# EAGLE design Electronic Brick Shield V4.0 pro (EAGLE 5.06)
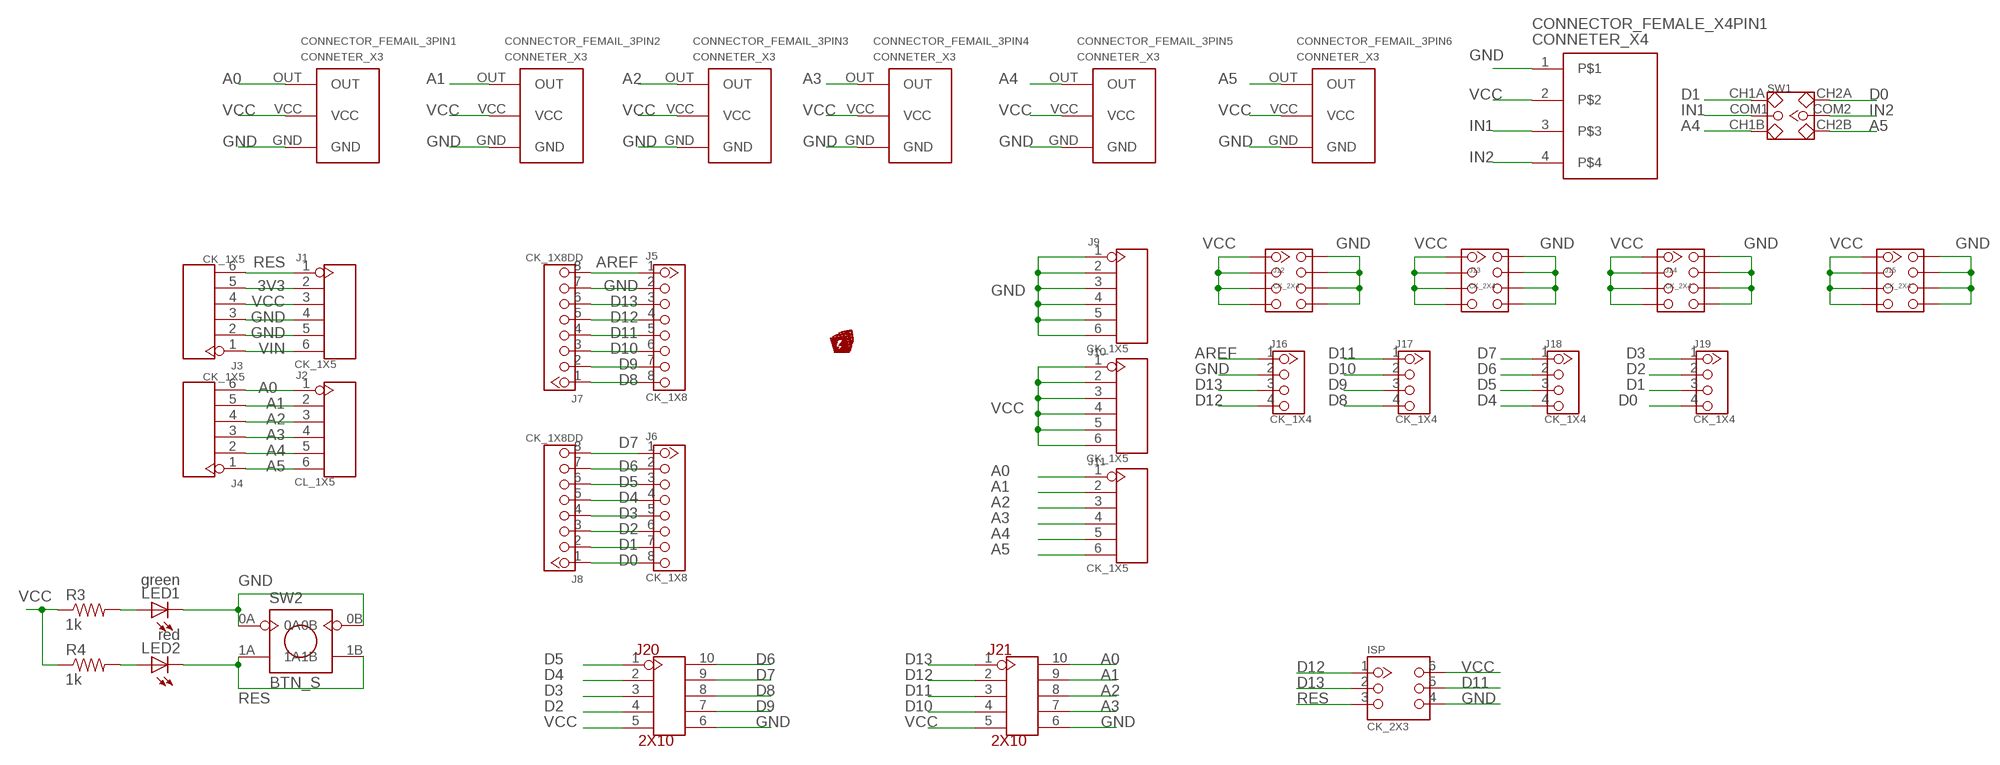
[diagram p0: schematic, sheet 1]

## Parts
CONNECTOR_FEMAIL_3PIN1  CONNETER_X3  [CONNETER_X3]
CONNECTOR_FEMAIL_3PIN2  CONNETER_X3  [CONNETER_X3]
CONNECTOR_FEMAIL_3PIN3  CONNETER_X3  [CONNETER_X3]
CONNECTOR_FEMAIL_3PIN4  CONNETER_X3  [CONNETER_X3]
CONNECTOR_FEMAIL_3PIN5  CONNETER_X3  [CONNETER_X3]
CONNECTOR_FEMAIL_3PIN6  CONNETER_X3  [CONNETER_X3]
CONNECTOR_FEMALE_X4PIN1  CONNETER_X4  [CONNETER_X4]
ISP  CK_2X3  [CK_2X3]
J1  CK_1X5  CK_1X6  [CK_1X6]
J2  CL_1X5  CK_1X6  [CK_1X6]
J3  CK_1X5  CK_1X6  [CK_1X6]
J4  CK_1X5  CK_1X6  [CK_1X6]
J5  CK_1X8  CK_1X8DD  [CK_1X8]
J6  CK_1X8  CK_1X8DD  [CK_1X8]
J7  CK_1X8DD  [CK_1X8]
J8  CK_1X8DD  [CK_1X8]
J9  CK_1X5  CK_1X6  [CK_1X6]
J10  CK_1X5  CK_1X6  [CK_1X6]
J11  CK_1X5  CK_1X6  [CK_1X6]
J12  CK_2X4  [CK_2X4]
J13  CK_2X4  [CK_2X4]
J14  CK_2X4  [CK_2X4]
J15  CK_2X4  [CK_2X4]
J16  CK_1X4  [CK_1X4]
J17  CK_1X4  [CK_1X4]
J18  CK_1X4  [CK_1X4]
J19  CK_1X4  [CK_1X4]
J20  2X10  CK_25  [CK_2*5]
J21  2X10  CK_25  [CK_2*5]
LED1  green  LED3MM  [LED3MM]
LED2  red  LED3MM  [LED3MM]
R3  1k  RESISTORPTH1  [AXIAL-0.3]
R4  1k  RESISTORPTH1  [AXIAL-0.3]
SW1  2.54SW_2CH  [2.54SW_2CH]
SW2  BTN_S  [BTN_S]
U$1  EB_150  [EB_150]

## Nets
3V3: J1.2 J3.5
A0: CONNECTOR_FEMAIL_3PIN1.OUT J2.1 J4.6 J11.1 J21.10
A1: CONNECTOR_FEMAIL_3PIN2.OUT J2.2 J4.5 J11.2 J21.9
A2: CONNECTOR_FEMAIL_3PIN3.OUT J2.3 J4.4 J11.3 J21.8
A3: CONNECTOR_FEMAIL_3PIN4.OUT J2.4 J4.3 J11.4 J21.7
A4: CONNECTOR_FEMAIL_3PIN5.OUT J2.5 J4.2 J11.5 SW1.CH1B
A5: CONNECTOR_FEMAIL_3PIN6.OUT J2.6 J4.1 J11.6 SW1.CH2B
AREF: J5.1 J7.8 J16.1
D0: J6.8 J8.1 J19.4 SW1.CH2A
D1: J6.7 J8.2 J19.3 SW1.CH1A
D2: J6.6 J8.3 J19.2 J20.4
D3: J6.5 J8.4 J19.1 J20.3
D4: J6.4 J8.5 J18.4 J20.2
D5: J6.3 J8.6 J18.3 J20.1
D6: J6.2 J8.7 J18.2 J20.10
D7: J6.1 J8.8 J18.1 J20.9
D8: J5.8 J7.1 J17.4 J20.8
D9: J5.7 J7.2 J17.3 J20.7
D10: J5.6 J7.3 J17.2 J21.4
D11: ISP.5 J5.5 J7.4 J17.1 J21.3
D12: ISP.1 J5.4 J7.5 J16.4 J21.2
D13: ISP.2 J5.3 J7.6 J16.3 J21.1
GND: CONNECTOR_FEMAIL_3PIN1.GND CONNECTOR_FEMAIL_3PIN2.GND CONNECTOR_FEMAIL_3PIN3.GND CONNECTOR_FEMAIL_3PIN4.GND CONNECTOR_FEMAIL_3PIN5.GND CONNECTOR_FEMAIL_3PIN6.GND CONNECTOR_FEMALE_X4PIN1.1 ISP.4 J1.4 J1.5 J3.2 J3.3 J5.2 J7.7 J9.1 J9.2 J9.3 J9.4 J9.5 J9.6 J12.5 J12.6 J12.7 J12.8 J13.5 J13.6 J13.7 J13.8 J14.5 J14.6 J14.7 J14.8 J15.5 J15.6 J15.7 J15.8 J16.2 J20.6 J21.6 LED1.K(C) SW2.0A SW2.0B
IN1: CONNECTOR_FEMALE_X4PIN1.3 SW1.COM1
IN2: CONNECTOR_FEMALE_X4PIN1.4 SW1.COM2
N$1: LED1.A R3.P$2
N$3: LED2.A R4.P$2
RES: ISP.3 J1.1 J3.6 LED2.K(C) SW2.1A SW2.1B
VCC: CONNECTOR_FEMAIL_3PIN1.VCC CONNECTOR_FEMAIL_3PIN2.VCC CONNECTOR_FEMAIL_3PIN3.VCC CONNECTOR_FEMAIL_3PIN4.VCC CONNECTOR_FEMAIL_3PIN5.VCC CONNECTOR_FEMAIL_3PIN6.VCC CONNECTOR_FEMALE_X4PIN1.2 ISP.6 J1.3 J3.4 J10.1 J10.2 J10.3 J10.4 J10.5 J10.6 J12.1 J12.2 J12.3 J12.4 J13.1 J13.2 J13.3 J13.4 J14.1 J14.2 J14.3 J14.4 J15.1 J15.2 J15.3 J15.4 J20.5 J21.5 R3.P$1 R4.P$1
VIN: J1.6 J3.1

## Library data of the parts
CONNECTOR_FEMAIL_3PIN1-CONNECTOR_FEMAIL_3PIN6 = AnlogDevice:CONNETER_X3
CONNECTOR_FEMALE_X4PIN1 = AnlogDevice:CONNETER_X4
ISP = CONNECTER:CK_2X3
J1-J4 J9-J11 = CONNECTER:CK_1X6
J5-J8 = CONNECTER:CK_1X8
J12-J15 = CONNECTER:CK_2X4
J16-J19 = CONNECTER:CK_1X4
J20 J21 = CONNECTER:CK_2*5
LED1 LED2 = SparkFun:LED: LEDs Standard schematic elements and footprints for 5mm, 3mm, 1206, and 0603 sized LEDs. 5mm - Spark Fun Electronics SKU : COM-00529 (and others)
R3 R4 = SparkFun:RESISTOR: Resistor Basic schematic elements and footprints for 0603, 1206, and PTH 1/10th watt (small) resistors.
SW1 = CPT_CJ:2.54SW_2CH
SW2 = CPT_SMD:BTN_S
U$1 = logo:EB_150

## Net classes
0 default: width 0.003 mm, drill 0.254 mm, clearance 0.152 mm

## Board
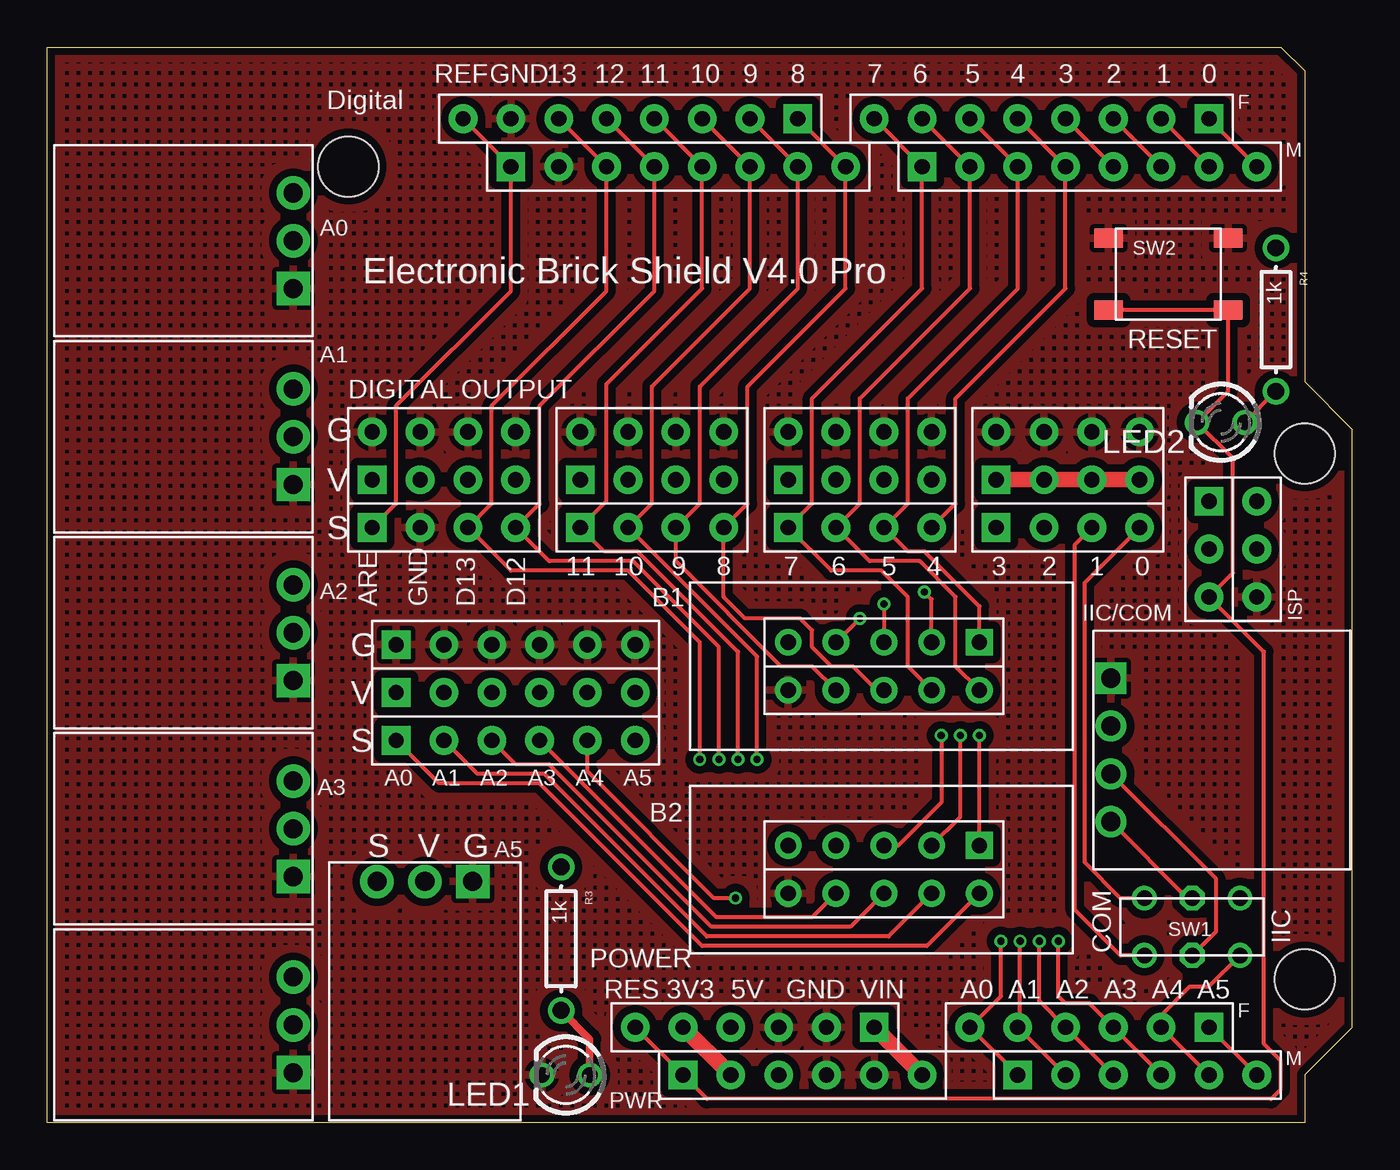
[diagram p1: board, top side]
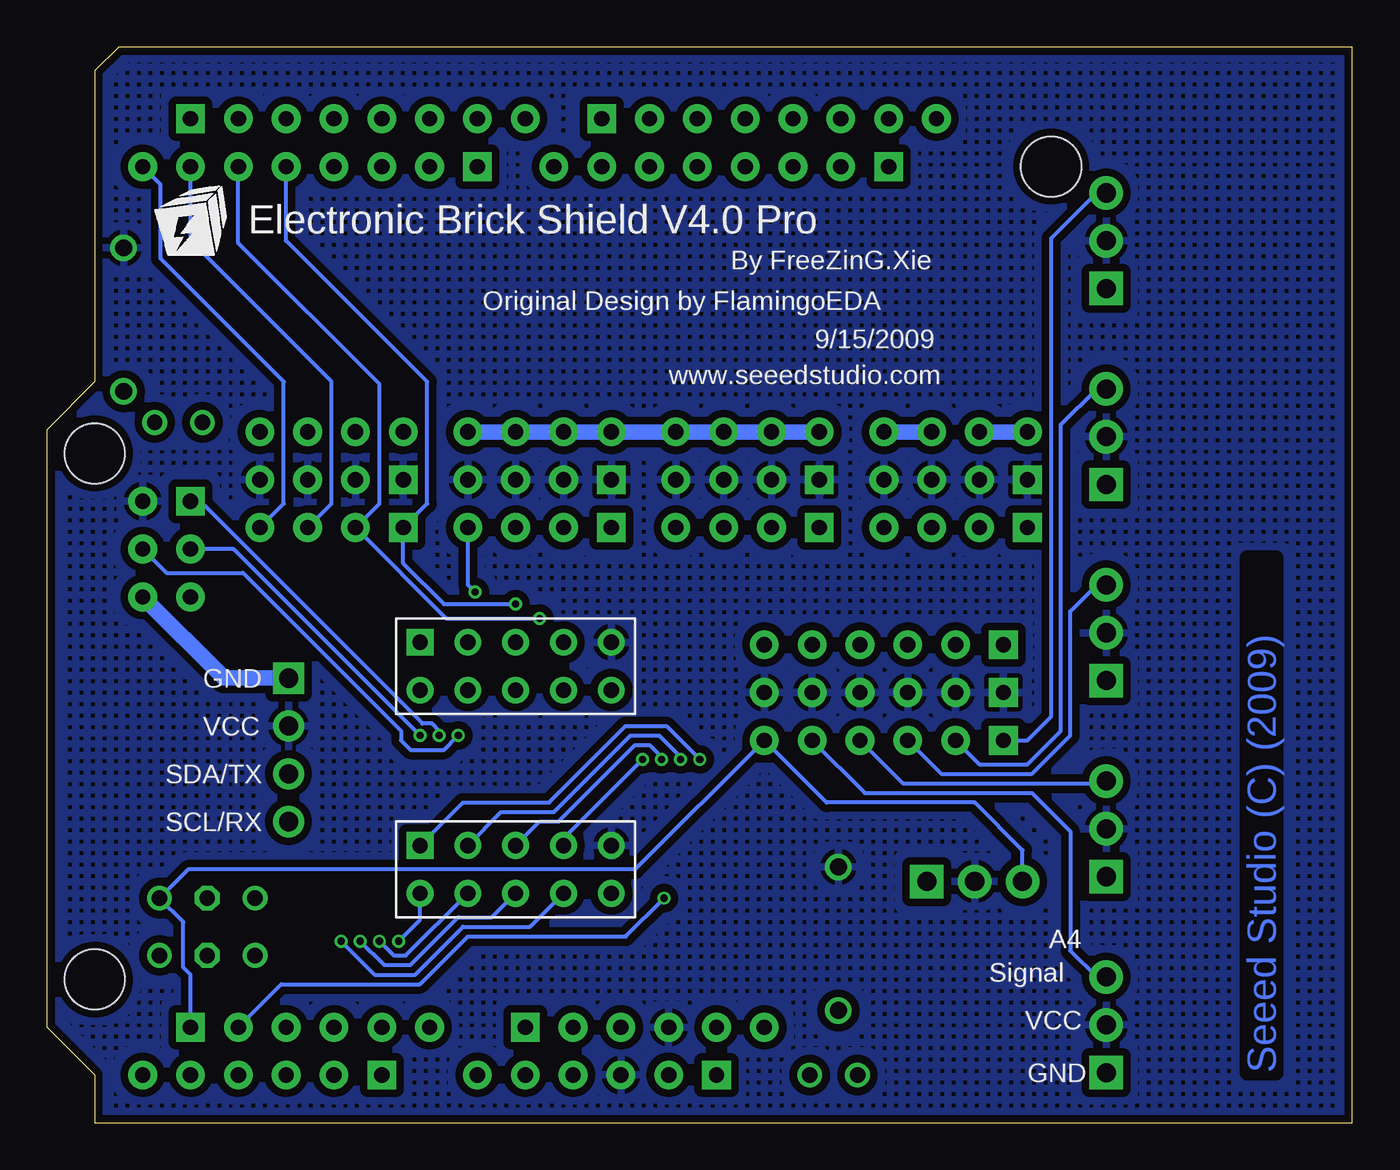
[diagram p2: board, bottom side, seen from below]

Size 69.34 x 57.15 mm. Coordinates in mm from the lower left corner, seen from the top.
Outline: 0,0 0,57.15 65.53,57.15 66.8,55.88 66.8,39.37 69.34,36.83 69.34,5.08 66.8,2.54 66.8,0 0,0
Copper layers (1*16): Top 0.035mm / dielectric 1.5mm / Bottom 0.035mm
Design rules "SeeedStudio_rule_090524": minimum track width 0.0025mm, minimum drill 10mil, track to track 6mil, track to pad 6mil, pad to pad 6mil, via to via 6mil, smd to smd 6mil, copper to edge 10mil, drill to drill 10mil, minimum pad ring 10mil, minimum via ring 6mil, stop-mask expansion 2mil, vias tented up to drill 100mil, thermal gap 10mil
Holes 3.2 mm at 16,50.8 66.8,7.62 66.8,35.56

### Footprints (pad centres in the part's own frame; a part is rotated, then mirrored left to right if it is on the bottom)
CONNETER_X3 = drill 1.016 pad 1.778 square: GND 0,0 | drill 1.016 pad 1.778 round: OUT 0,-5.08; VCC 0,-2.54
CONNETER_X4 = drill 1.016 pad 1.651 square: 1 0,3.81 | drill 1.016 pad 1.651 round: 2 0,1.27; 3 0,-1.27; 4 0,-3.81
CK_2X3 = drill 0.813 pad 1.524 square: 1 -1.27,2.54 | drill 0.813 pad 1.524 round: 2 -1.27,0; 3 -1.27,-2.54; 4 1.27,-2.54; 5 1.27,0; 6 1.27,2.54
CK_1X6 = drill 0.813 pad 1.524 square: 1 0,6.35 | drill 0.813 pad 1.524 round: 2 0,3.81; 3 0,1.27; 4 0,-1.27; 5 0,-3.81; 6 0,-6.35
CK_1X8 = drill 0.813 pad 1.524 square: 1 0,8.89 | drill 0.813 pad 1.524 round: 2 0,6.35; 3 0,3.81; 4 0,1.27; 5 0,-1.27; 6 0,-3.81; 7 0,-6.35; 8 0,-8.89
CK_2X4 = drill 0.813 pad 1.524 square: 1 -1.27,3.81 | drill 0.813 pad 1.524 round: 2 -1.27,1.27; 3 -1.27,-1.27; 4 -1.27,-3.81; 5 1.27,-3.81; 6 1.27,-1.27; 7 1.27,1.27; 8 1.27,3.81
CK_1X4 = drill 0.813 pad 1.524 square: 1 0,3.81 | drill 0.813 pad 1.524 round: 2 0,1.27; 3 0,-1.27; 4 0,-3.81
CK_2*5 = drill 0.813 pad 1.422 square: 1 -1.27,5.08 | drill 0.813 pad 1.422 round: 2 -1.27,2.54; 3 -1.27,0; 4 -1.27,-2.54; 5 -1.27,-5.08; 6 1.27,-5.08; 7 1.27,-2.54; 8 1.27,0; 9 1.27,2.54; 10 1.27,5.08
LED3MM = drill 0.813 round: A -1.27,0; K 1.27,0
AXIAL-0.3 = drill 0.9 round: P$1 -3.81,0; P$2 3.81,0
2.54SW_2CH = drill 0.813 pad 1.27 round: CH1A -1.524,2.54; CH1B -1.524,-2.54; CH2A 1.524,2.54; CH2B 1.524,-2.54 | drill 0.813 pad 1.27 octagon: COM1 -1.524,0; COM2 1.524,0
BTN_S = smd 1.524 x 1.016: 0A -3.175,1.905; 0B 3.175,1.905; 1A -3.175,-1.905; 1B 3.175,-1.905

### Placement (x,y rotation side)
CONNECTOR_FEMAIL_3PIN1  13.08,44.32 180 top
CONNECTOR_FEMAIL_3PIN2  13.08,33.91 180 top
CONNECTOR_FEMAIL_3PIN3  13.08,23.5 180 top
CONNECTOR_FEMAIL_3PIN4  13.08,13.08 180 top
CONNECTOR_FEMAIL_3PIN5  13.08,2.67 180 top
CONNECTOR_FEMAIL_3PIN6  22.61,12.83 270 top
CONNECTOR_FEMALE_X4PIN1  56.52,19.81 0 top
ISP  62.99,30.48 0 top
J1  40.13,2.54 90 top
J2  57.91,2.54 90 top
J3  37.59,5.08 270 top
J4  55.37,5.08 270 top
J5  33.53,50.8 90 top
J6  55.37,50.8 90 top
J7  30.99,53.34 270 top
J8  52.83,53.34 270 top
J9  24.89,25.4 90 top
J10  24.89,22.86 90 top
J11  24.89,20.32 90 top
J12  21.08,35.43 90 top
J13  32.13,35.43 90 top
J14  43.18,35.43 90 top
J15  54.23,35.43 90 top
J16  21.08,31.62 90 top
J17  32.13,31.62 90 top
J18  43.18,31.62 90 top
J19  54.23,31.62 90 top
J20  44.45,24.26 270 top
J21  44.45,13.46 270 top
LED1  27.56,2.54 180 top
LED2  62.36,37.21 180 top
R3  27.3,9.78 270 top
R4  65.28,42.67 270 top
SW1  60.83,10.41 90 top
SW2  59.56,45.09 0 top
U$1  61.72,47.62 0 bottom

### Tracks (layer width: path | path; a pad name or v marks a point on that pad's centre or on a via)
3V3
  Top 0.813: J1.2 J3.5
A0  (via drill 0.38)
  Top 0.203: J2.1 J4.6 50.67,6.73 v50.67,9.65 | J21.10 46.74,9.4 34.8,9.4 26.16,18.03 20.83,18.03 J11.1
  Bottom 0.203: J21.10 49.53,10.79 v50.67,9.65 | J11.1 17.27,20.32 16,21.59 16,46.99 13.59,49.4 CONNECTOR_FEMAIL_3PIN1.OUT
A1  (via drill 0.38)
  Top 0.203: J2.2 J4.5 51.69,5.21 v51.69,9.65 | J21.9 44.7,9.91 35.05,9.91 26.42,18.54 22.86,18.54 J11.2
  Bottom 0.203: J21.9 50.29,8.89 50.93,8.89 v51.69,9.65 | J11.2 19.81,19.05 17.27,19.05 15.49,20.83 15.49,37.08 13.59,38.99 CONNECTOR_FEMAIL_3PIN2.OUT
A2  (via drill 0.38)
  Top 0.203: J2.3 J4.4 52.7,6.48 v52.7,9.65 | J21.8 42.67,10.41 35.31,10.41 26.67,19.05 24.89,19.05 J11.3
  Bottom 0.203: v52.7,9.65 51.44,8.38 50.04,8.38 47.5,10.92 45.72,10.92 J21.8 | J11.3 21.84,18.54 17.02,18.54 14.99,20.57 14.99,27.18 13.59,28.57 CONNECTOR_FEMAIL_3PIN3.OUT
A3  (via drill 0.38)
  Top 0.203: J2.4 J4.3 55.37,6.35 54.1,6.35 53.72,6.73 v53.72,9.65 | J21.7 40.64,10.92 35.56,10.92 J11.4
  Bottom 0.203: J21.7 43.69,10.41 47.24,10.41 49.78,7.87 51.94,7.87 v53.72,9.65 | J11.4 23.88,18.03 13.21,18.03 CONNECTOR_FEMAIL_3PIN4.OUT
A4  (via drill 0.38)
  Top 0.203: J2.5 J4.2 59.18,5.71 60.71,7.24 61.72,7.24 SW1.CH1B | J11.5 28.7,18.67 35.43,11.94 v36.58,11.94
  Bottom 0.203: v36.58,11.94 38.61,9.91 46.99,9.91 49.53,7.37 56.9,7.37 J4.2 | J11.5 25.91,17.53 17.02,17.53 14.99,15.49 14.99,9.14 13.59,7.75 CONNECTOR_FEMAIL_3PIN5.OUT
A5
  Top 0.203: J4.1 J2.6
  Bottom 0.203: CONNECTOR_FEMAIL_3PIN6.OUT 17.53,14.48 20.07,17.02 27.94,17.02 J11.6 38.1,13.46 61.85,13.46 SW1.CH2B 62.1,10.67 62.1,8.26 61.72,7.87 J4.1
AREF
  Top 0.203: J7.8 J5.1 24.64,44.2 18.54,38.1 18.54,32.89 J16.1
D0
  Top 0.203: J19.4 55.12,28.7 55.12,13.84 57.02,11.94 SW1.CH2A | J6.8 J8.1
  Bottom 0.203: J19.4 56.77,32.89 56.77,39.37 63.31,45.91 63.31,49.85 J6.8
D1
  Top 0.203: J19.3 54.61,30.73 54.61,11.3 57.02,8.89 SW1.CH1A | J6.7 J8.2
  Bottom 0.203: J6.7 61.72,46.86 54.23,39.37 54.23,32.89 J19.3
D2  (via drill 0.38)
  Top 0.203: J6.6 J8.3 | v43.18,26.8 J20.4
  Bottom 0.203: v43.18,26.8 48.13,26.8 J19.2 51.69,32.89 51.69,39.24 59.18,46.74 J6.6
D3  (via drill 0.38)
  Top 0.203: J6.5 J8.4 | v44.45,27.56 J20.3
  Bottom 0.203: v44.45,27.56 48.26,27.56 50.42,29.72 J19.1 49.15,32.89 49.15,39.37 56.64,46.86 J6.5
D4  (via drill 0.38)
  Top 0.203: J8.5 J6.4 54.1,44.32 48.26,38.48 48.26,32.89 J18.4 | v46.61,28.19 46.99,27.81 J20.2
  Bottom 0.203: v46.61,28.19 46.99,28.57 J18.4
D5
  Top 0.203: J8.6 J6.3 51.56,44.32 45.72,38.48 45.72,32.89 J18.3 45.72,30.35 46.61,30.35 49.53,27.43 J20.1
D6
  Top 0.203: J8.7 J6.2 49.02,44.32 43.18,38.48 43.18,32.89 J18.2 43.69,29.84 46.36,29.84 48.26,27.94 48.26,24.26 J20.10
D7
  Top 0.203: J8.8 J6.1 46.48,44.32 40.64,38.48 40.64,32.89 J18.1 41.66,29.34 44.32,29.34 45.72,27.94 45.72,24.26 J20.9
D8
  Top 0.203: J7.1 J5.8 42.42,44.32 37.21,39.12 37.21,32.89 J17.4 35.94,27.94 37.08,26.8 40.01,26.8 40.64,26.16 40.64,25.27 41.66,24.26 42.8,24.26 44.07,22.99 J20.8
D9
  Top 0.203: J7.2 J5.7 39.88,44.32 34.67,39.12 34.67,32.89 J17.3 33.4,29.84 38.99,24.26 40.64,24.26 J20.7
D10  (via drill 0.38)
  Top 0.203: v37.72,19.3 37.72,24.77 J17.2 32.13,32.89 32.13,39.12 37.34,44.32 J5.6 J7.3
  Bottom 0.203: v37.72,19.3 41.91,15.11 J21.4
D11  (via drill 0.38)
  Top 0.203: v36.7,19.3 36.7,25.02 31.37,30.35 29.59,30.35 J17.1 29.72,33.02 29.72,39.24 34.8,44.32 J5.5 J7.4 | J21.3 45.21,14.73 47.5,17.02 v47.5,20.57
  Bottom 0.203: J21.3 43.18,16 42.16,16 38.1,20.07 37.34,20.07 36.7,19.43 v36.7,19.3 | ISP.5 62.99,29.21 58.93,29.21 50.55,20.83 50.55,20.32 50.04,19.81 48.26,19.81 v47.5,20.57
D12  (via drill 0.38)
  Top 0.203: v35.69,19.3 35.69,25.27 31.12,29.84 26.67,29.84 J16.4 26.16,32.89 26.16,38.1 32.26,44.2 J5.4 J7.5 | J21.2 48.51,16.26 v48.51,20.57
  Bottom 0.203: J21.2 45.21,16.51 42.42,16.51 38.35,20.57 36.83,20.57 35.69,19.43 v35.69,19.3 | ISP.1 61.21,33.02 49.4,21.21 48.9,21.21 48.51,20.83 v48.51,20.57
D13  (via drill 0.38)
  Top 0.203: v34.67,19.3 34.67,25.53 30.86,29.34 24.64,29.34 J16.3 23.62,32.89 23.62,38.1 29.72,44.2 J5.3 J7.6 | J21.1 v49.53,20.57
  Bottom 0.203: v34.67,19.3 36.45,21.08 38.61,21.08 42.67,17.02 47.24,17.02 J21.1 | ISP.2 59.44,30.48 v49.53,20.57
GND
  Bottom 0.813: CONNECTOR_FEMALE_X4PIN1.1 59.94,23.62 ISP.4 | J12.7 J12.8 | J12.5 J12.6 | J13.8 J13.7 J13.6 J13.5 J14.8 J14.7 J14.6 J14.5
  pour Top (isolate 0.406, hatched): 0,57.15 69.34,57.15 69.34,0 0,0
IN1
  Top 0.203: CONNECTOR_FEMALE_X4PIN1.3 62.1,12.95 62.1,10.16 SW1.COM1
IN2
  Top 0.203: CONNECTOR_FEMALE_X4PIN1.4 60.58,11.94 SW1.COM2
N$1
  Top 0.406: R3.P$2 28.83,4.45 LED1.A
N$3
  Top 0.203: LED2.A R4.P$2
RES
  Top 0.203: J3.6 J1.1 35.05,1.27 65.02,1.27 65.53,1.78 65.53,3.3 64.64,4.19 64.64,25.02 ISP.3 62.99,29.21 62.99,35.31 LED2.K 62.74,38.86 SW2.1B SW2.1A
VCC
  Top 0.813: J15.1 J15.2 J15.3 | J15.3 55.63,34.16 | J15.4 J15.3
  pour Bottom (isolate 0.406, hatched): 0,57.15 69.34,57.15 69.34,0 0,0
VIN
  Top 0.813: J1.6 J3.1

### Text on the board
Bottom: Seeed Studio (C) (2009)
tPlace: REF | GND | 13 | 12 | 11 | 10 | 9 | 8 | 7 | 6 | 5 | 4 | 3 | 2 | 1 | 0 | Digital | F | M | A0 | Electronic Brick Shield V4.0 Pro | RESET | A1 | DIGITAL OUTPUT | G | V | S | 11 | 10 | 9 | 8 | 7 | 6 | 5 | 4 | 3 | 2 | 1 | 0 | A2 | ARE | GND | D13 | D12 | B1 | IIC/COM | G | V | S | A0 | A1 | A2 | A3 | A4 | A5 | A3 | B2 | S | V | G | A5 | IIC | COM | POWER | RES | 3V3 | 5V | GND | VIN | A0 | A1 | A2 | A3 | A4 | A5 | F | M | PWR
bPlace: Electronic Brick Shield V4.0 Pro | By FreeZinG.Xie | Original Design by FlamingoEDA | 9/15/2009 | www.seeedstudio.com | GND | VCC | SDA/TX | SCL/RX | A4 | Signal | VCC | GND